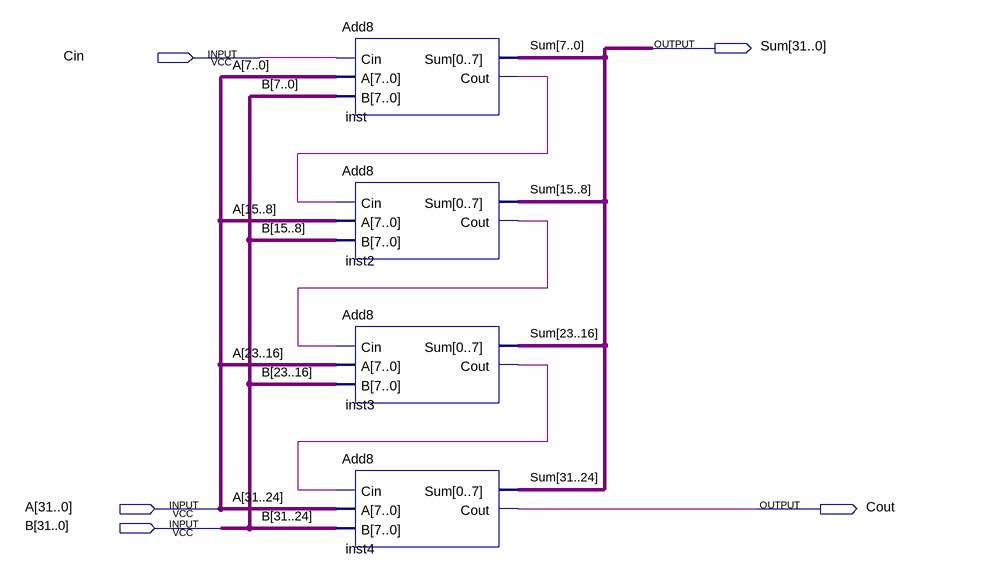
[diagram p0: schematic sheet]
// Quartus schematic Add32.bdf as structural Verilog: 4 symbols, 5 pins
module Add32 (
  input  Cin,
  input  [31:0] A,
  input  [31:0] B,
  output [31:0] Sum,
  output Cout
);

  wire inst2_cout, inst3_cout, inst_cout;

  Add8 inst (.Cin(Cin), .A(A[7:0]), .B(B[7:0]), .Sum(Sum[7:0]), .Cout(inst_cout));
  Add8 inst2 (.Cin(inst_cout), .A(A[15:8]), .B(B[15:8]), .Sum(Sum[15:8]), .Cout(inst2_cout));
  Add8 inst3 (.Cin(inst2_cout), .A(A[23:16]), .B(B[23:16]), .Sum(Sum[23:16]), .Cout(inst3_cout));
  Add8 inst4 (.Cin(inst3_cout), .A(A[31:24]), .B(B[31:24]), .Sum(Sum[31:24]), .Cout(Cout));
endmodule
